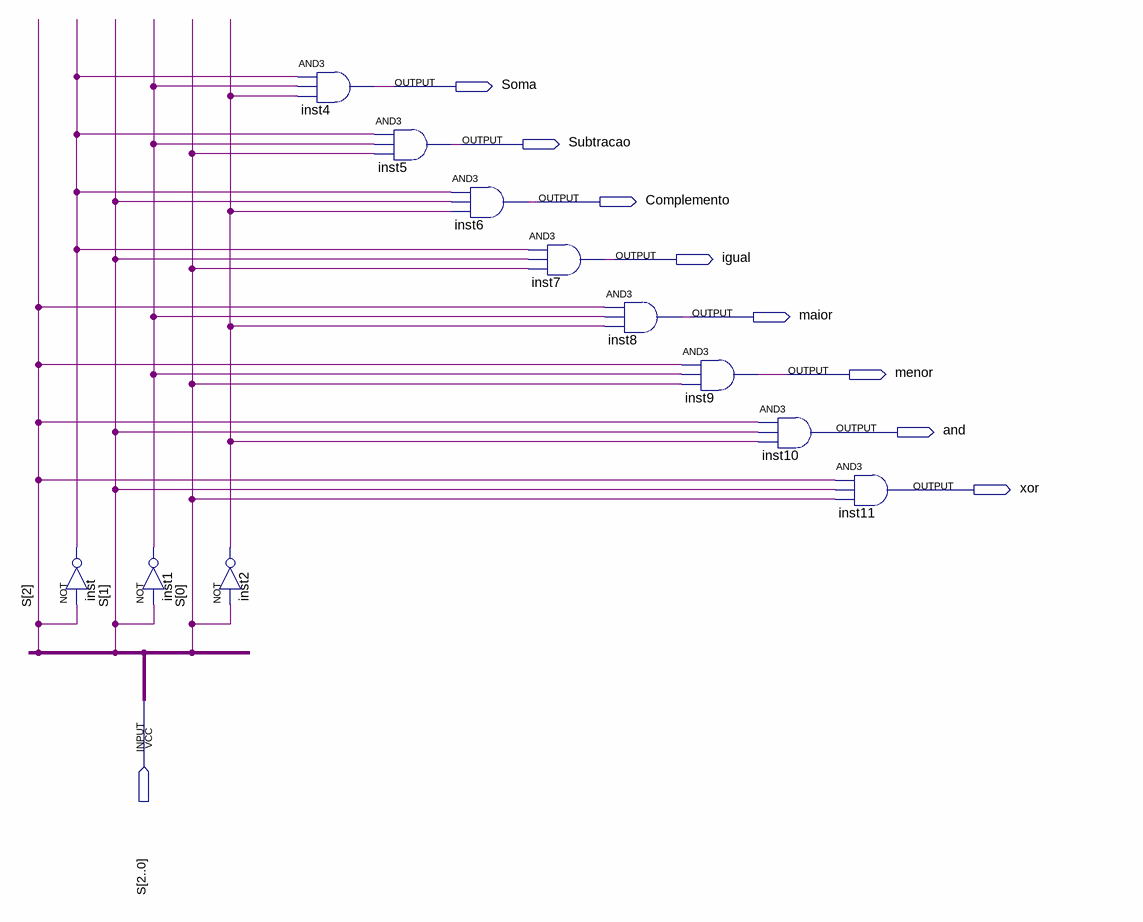
[diagram p0: schematic sheet]
// Quartus schematic decodificadorULA.bdf as structural Verilog: 11 symbols, 9 pins
module decodificadorULA (
  input  [2:0] S,
  output Soma,
  output Subtracao,
  output Complemento,
  output igual,
  output maior,
  output menor,
  output \and ,
  output \xor 
);

  wire inst1_out, inst2_out, inst_out;

  not inst (inst_out, S[2]);
  not inst1 (inst1_out, S[1]);
  not inst2 (inst2_out, S[0]);
  and inst4 (Soma, inst_out, inst1_out, inst2_out);
  and inst5 (Subtracao, inst_out, inst1_out, S[0]);
  and inst6 (Complemento, inst_out, S[1], inst2_out);
  and inst7 (igual, inst_out, S[1], S[0]);
  and inst8 (maior, S[2], inst1_out, inst2_out);
  and inst9 (menor, S[2], inst1_out, S[0]);
  and inst10 (\and , S[2], S[1], inst2_out);
  and inst11 (\xor , S[2], S[1], S[0]);
endmodule
